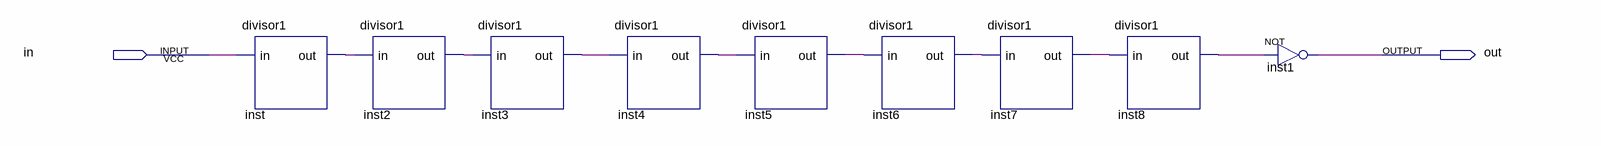
[diagram p0: schematic sheet]
// Quartus schematic divisor8.bdf as structural Verilog: 9 symbols, 2 pins
module divisor8 (
  input  in,
  output out
);

  wire inst2_out, inst3_out, inst4_out, inst5_out, inst6_out, inst7_out, inst8_out, inst_out;

  divisor1 inst (.in(in), .out(inst_out));
  divisor1 inst2 (.in(inst_out), .out(inst2_out));
  divisor1 inst3 (.in(inst2_out), .out(inst3_out));
  divisor1 inst4 (.in(inst3_out), .out(inst4_out));
  divisor1 inst5 (.in(inst4_out), .out(inst5_out));
  divisor1 inst6 (.in(inst5_out), .out(inst6_out));
  divisor1 inst7 (.in(inst6_out), .out(inst7_out));
  divisor1 inst8 (.in(inst7_out), .out(inst8_out));
  not inst1 (out, inst8_out);
endmodule
